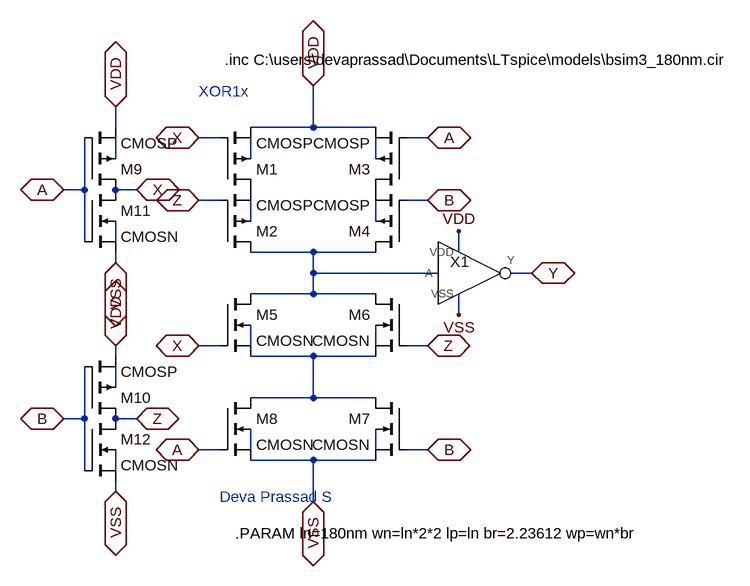
[diagram p0: schematic xor1x.asc]
xor1x.asc, the LTspice schematic file:
Version 4.1
SHEET 1 880 756
WIRE -208 96 -208 64
WIRE 96 96 96 32
WIRE 96 96 0 96
WIRE 192 96 96 96
WIRE -48 112 -80 112
WIRE 272 112 240 112
WIRE -208 144 -208 112
WIRE 0 144 0 112
WIRE 192 144 192 112
WIRE -256 192 -256 112
WIRE -256 192 -288 192
WIRE -176 192 -208 192
WIRE -48 208 -80 208
WIRE 272 208 240 208
WIRE 0 240 0 208
WIRE 192 240 192 208
WIRE -256 272 -256 192
WIRE -208 272 -208 240
WIRE 96 288 0 288
WIRE 192 288 96 288
WIRE 320 288 320 256
WIRE -208 304 -208 288
WIRE 96 320 96 288
WIRE 288 320 96 320
WIRE 432 320 400 320
WIRE 96 352 96 320
WIRE 96 352 0 352
WIRE 192 352 96 352
WIRE 320 384 320 352
WIRE -48 432 -80 432
WIRE 0 432 0 400
WIRE 192 432 192 400
WIRE 272 432 240 432
WIRE -208 448 -208 432
WIRE 96 448 0 448
WIRE 192 448 96 448
WIRE -208 496 -208 464
WIRE 96 512 96 448
WIRE 96 512 0 512
WIRE 192 512 96 512
WIRE -256 544 -256 464
WIRE -256 544 -288 544
WIRE -176 544 -208 544
WIRE -48 592 -80 592
WIRE 0 592 0 560
WIRE 192 592 192 560
WIRE 272 592 240 592
WIRE 96 608 0 608
WIRE 192 608 96 608
WIRE -256 624 -256 544
WIRE -208 624 -208 592
WIRE -208 656 -208 640
WIRE 96 672 96 608
FLAG 432 320 Y
IOPIN 432 320 BiDir
FLAG 96 32 VDD
IOPIN 96 32 BiDir
FLAG 96 672 VSS
IOPIN 96 672 BiDir
FLAG -176 192 X
IOPIN -176 192 BiDir
FLAG -208 64 VDD
IOPIN -208 64 BiDir
FLAG -208 304 VSS
IOPIN -208 304 BiDir
FLAG -288 192 A
IOPIN -288 192 BiDir
FLAG -176 544 Z
IOPIN -176 544 BiDir
FLAG -208 432 VDD
IOPIN -208 432 BiDir
FLAG -288 544 B
IOPIN -288 544 BiDir
FLAG -208 656 VSS
IOPIN -208 656 BiDir
FLAG -80 208 Z
IOPIN -80 208 BiDir
FLAG -80 112 X
IOPIN -80 112 BiDir
FLAG 272 112 A
IOPIN 272 112 BiDir
FLAG 272 208 B
IOPIN 272 208 BiDir
FLAG 272 432 Z
IOPIN 272 432 BiDir
FLAG 272 592 B
IOPIN 272 592 BiDir
FLAG -80 592 A
IOPIN -80 592 BiDir
FLAG -80 432 X
IOPIN -80 432 BiDir
FLAG 320 256 VDD
FLAG 320 384 VSS
SYMBOL pmos4 -48 192 M180
SYMATTR InstName M1
SYMATTR Value CMOSP
SYMATTR Value2 l={lp} w={wp} ad={lp*wp} as={lp*wp} pd={2*lp+wp} ps={2*lp+wp}
SYMBOL pmos4 -48 288 M180
SYMATTR InstName M2
SYMATTR Value CMOSP
SYMATTR Value2 l={lp} w={wp} ad={lp*wp} as={lp*wp} pd={2*lp+wp} ps={2*lp+wp}
SYMBOL pmos4 240 192 R180
SYMATTR InstName M3
SYMATTR Value CMOSP
SYMATTR Value2 l={lp} w={wp} ad={lp*wp} as={lp*wp} pd={2*lp+wp} ps={2*lp+wp}
SYMBOL pmos4 240 288 R180
SYMATTR InstName M4
SYMATTR Value CMOSP
SYMATTR Value2 l={lp} w={wp} ad={lp*wp} as={lp*wp} pd={2*lp+wp} ps={2*lp+wp}
SYMBOL nmos4 -48 352 R0
SYMATTR InstName M5
SYMATTR Value CMOSN
SYMATTR Value2 l={ln} w={wn} ad={ln*wn} as={ln*wn} pd={2*ln+wn} ps={2*ln+wn}
SYMBOL nmos4 240 352 M0
SYMATTR InstName M6
SYMATTR Value CMOSN
SYMATTR Value2 l={ln} w={wn} ad={ln*wn} as={ln*wn} pd={2*ln+wn} ps={2*ln+wn}
SYMBOL nmos4 240 512 M0
SYMATTR InstName M7
SYMATTR Value CMOSN
SYMATTR Value2 l={ln} w={wn} ad={ln*wn} as={ln*wn} pd={2*ln+wn} ps={2*ln+wn}
SYMBOL nmos4 -48 512 R0
SYMATTR InstName M8
SYMATTR Value CMOSN
SYMATTR Value2 l={ln} w={wn} ad={ln*wn} as={ln*wn} pd={2*ln+wn} ps={2*ln+wn}
SYMBOL pmos4 -256 192 M180
SYMATTR InstName M9
SYMATTR Value CMOSP
SYMATTR Value2 l={lp} w={wp} ad={lp*wp} as={lp*wp} pd={2*lp+wp} ps={2*lp+wp}
SYMBOL pmos4 -256 544 M180
SYMATTR InstName M10
SYMATTR Value CMOSP
SYMATTR Value2 l={lp} w={wp} ad={lp*wp} as={lp*wp} pd={2*lp+wp} ps={2*lp+wp}
SYMBOL nmos4 -256 192 R0
SYMATTR InstName M11
SYMATTR Value CMOSN
SYMATTR Value2 l={ln} w={wn} ad={ln*wn} as={ln*wn} pd={2*ln+wn} ps={2*ln+wn}
SYMBOL nmos4 -256 544 R0
SYMATTR InstName M12
SYMATTR Value CMOSN
SYMATTR Value2 l={ln} w={wn} ad={ln*wn} as={ln*wn} pd={2*ln+wn} ps={2*ln+wn}
SYMBOL diglib\\inv1x\\inv1x 352 320 R0
SYMATTR InstName X1
TEXT -80 40 Left 2 ;XOR1x
TEXT -48 664 Left 2 ;Deva Prassad S
TEXT -24 720 Left 2 !.PARAM ln=180nm wn=ln*2*2 lp=ln br=2.23612 wp=wn*br
TEXT -40 -8 Left 2 !.inc C:\\users\\devaprassad\\Documents\\LTspice\\models\\bsim3_180nm.cir

The netlist it stands for:
* xor1x.asc
M1 P001 X VDD N002 CMOSP l={lp} w={wp} ad={lp*wp} as={lp*wp} pd={2*lp+wp} ps={2*lp+wp}
M2 N007 Z P001 N004 CMOSP l={lp} w={wp} ad={lp*wp} as={lp*wp} pd={2*lp+wp} ps={2*lp+wp}
M3 P002 A VDD N003 CMOSP l={lp} w={wp} ad={lp*wp} as={lp*wp} pd={2*lp+wp} ps={2*lp+wp}
M4 N007 B P002 N005 CMOSP l={lp} w={wp} ad={lp*wp} as={lp*wp} pd={2*lp+wp} ps={2*lp+wp}
M5 N007 X N010 N008 CMOSN l={ln} w={wn} ad={ln*wn} as={ln*wn} pd={2*ln+wn} ps={2*ln+wn}
M6 N007 Z N010 N009 CMOSN l={ln} w={wn} ad={ln*wn} as={ln*wn} pd={2*ln+wn} ps={2*ln+wn}
M7 N010 B VSS N013 CMOSN l={ln} w={wn} ad={ln*wn} as={ln*wn} pd={2*ln+wn} ps={2*ln+wn}
M8 N010 A VSS N012 CMOSN l={ln} w={wn} ad={ln*wn} as={ln*wn} pd={2*ln+wn} ps={2*ln+wn}
M9 X A VDD N001 CMOSP l={lp} w={wp} ad={lp*wp} as={lp*wp} pd={2*lp+wp} ps={2*lp+wp}
M10 Z B VDD N011 CMOSP l={lp} w={wp} ad={lp*wp} as={lp*wp} pd={2*lp+wp} ps={2*lp+wp}
M11 X A VSS N006 CMOSN l={ln} w={wn} ad={ln*wn} as={ln*wn} pd={2*ln+wn} ps={2*ln+wn}
M12 Z B VSS N014 CMOSN l={ln} w={wn} ad={ln*wn} as={ln*wn} pd={2*ln+wn} ps={2*ln+wn}
X§X1 N007 VDD VSS Y inv1x  ; pins A VDD VSS Y
.model NMOS NMOS
.model PMOS PMOS
.lib standard.mos
* XOR1x
* Deva Prassad S
.PARAM ln=180nm wn=ln*2*2 lp=ln br=2.23612 wp=wn*br
.inc C:\users\devaprassad\Documents\LTspice\models\bsim3_180nm.cir
.backanno
.end